# EasyEDA Pro project 数字电容表（嘉立创专业版）.epro, board 数字电容表PCB图
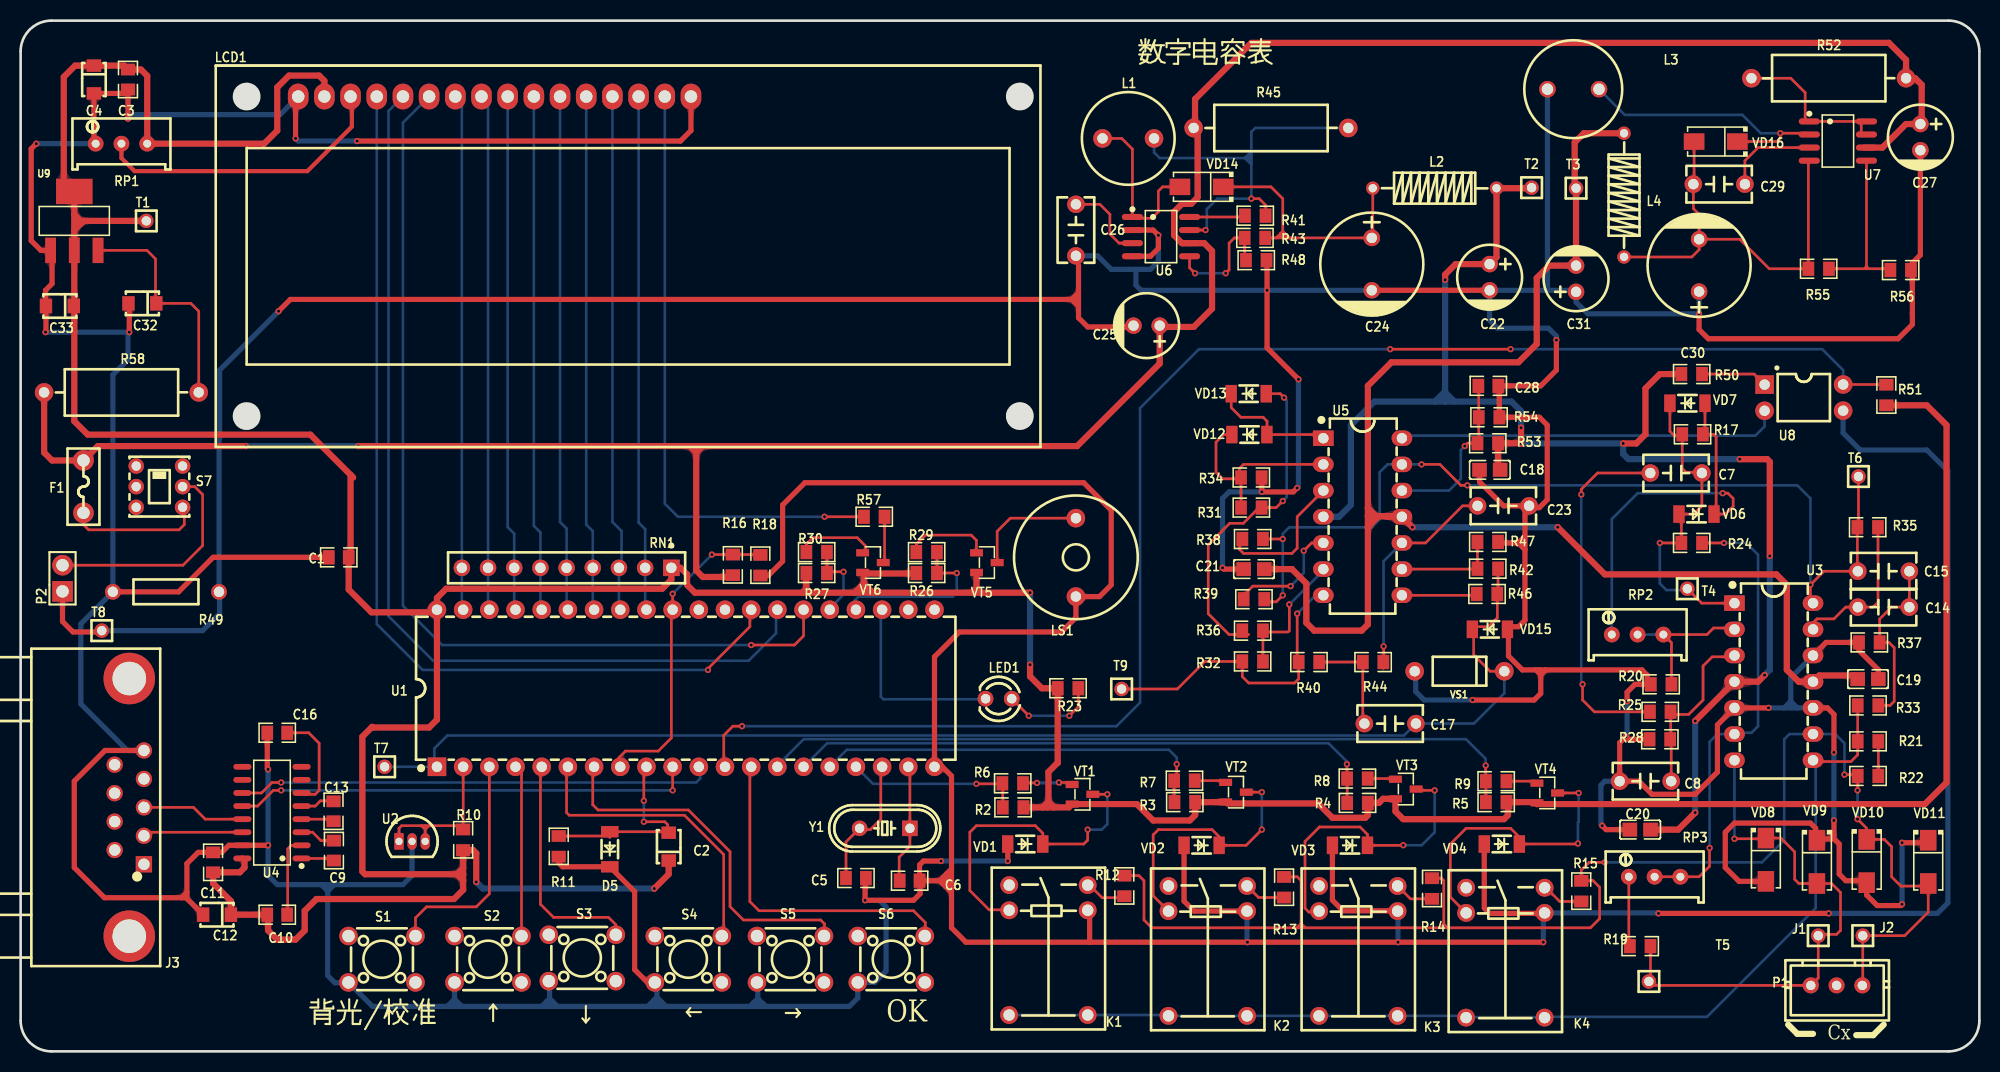
[diagram p1: board, top side]
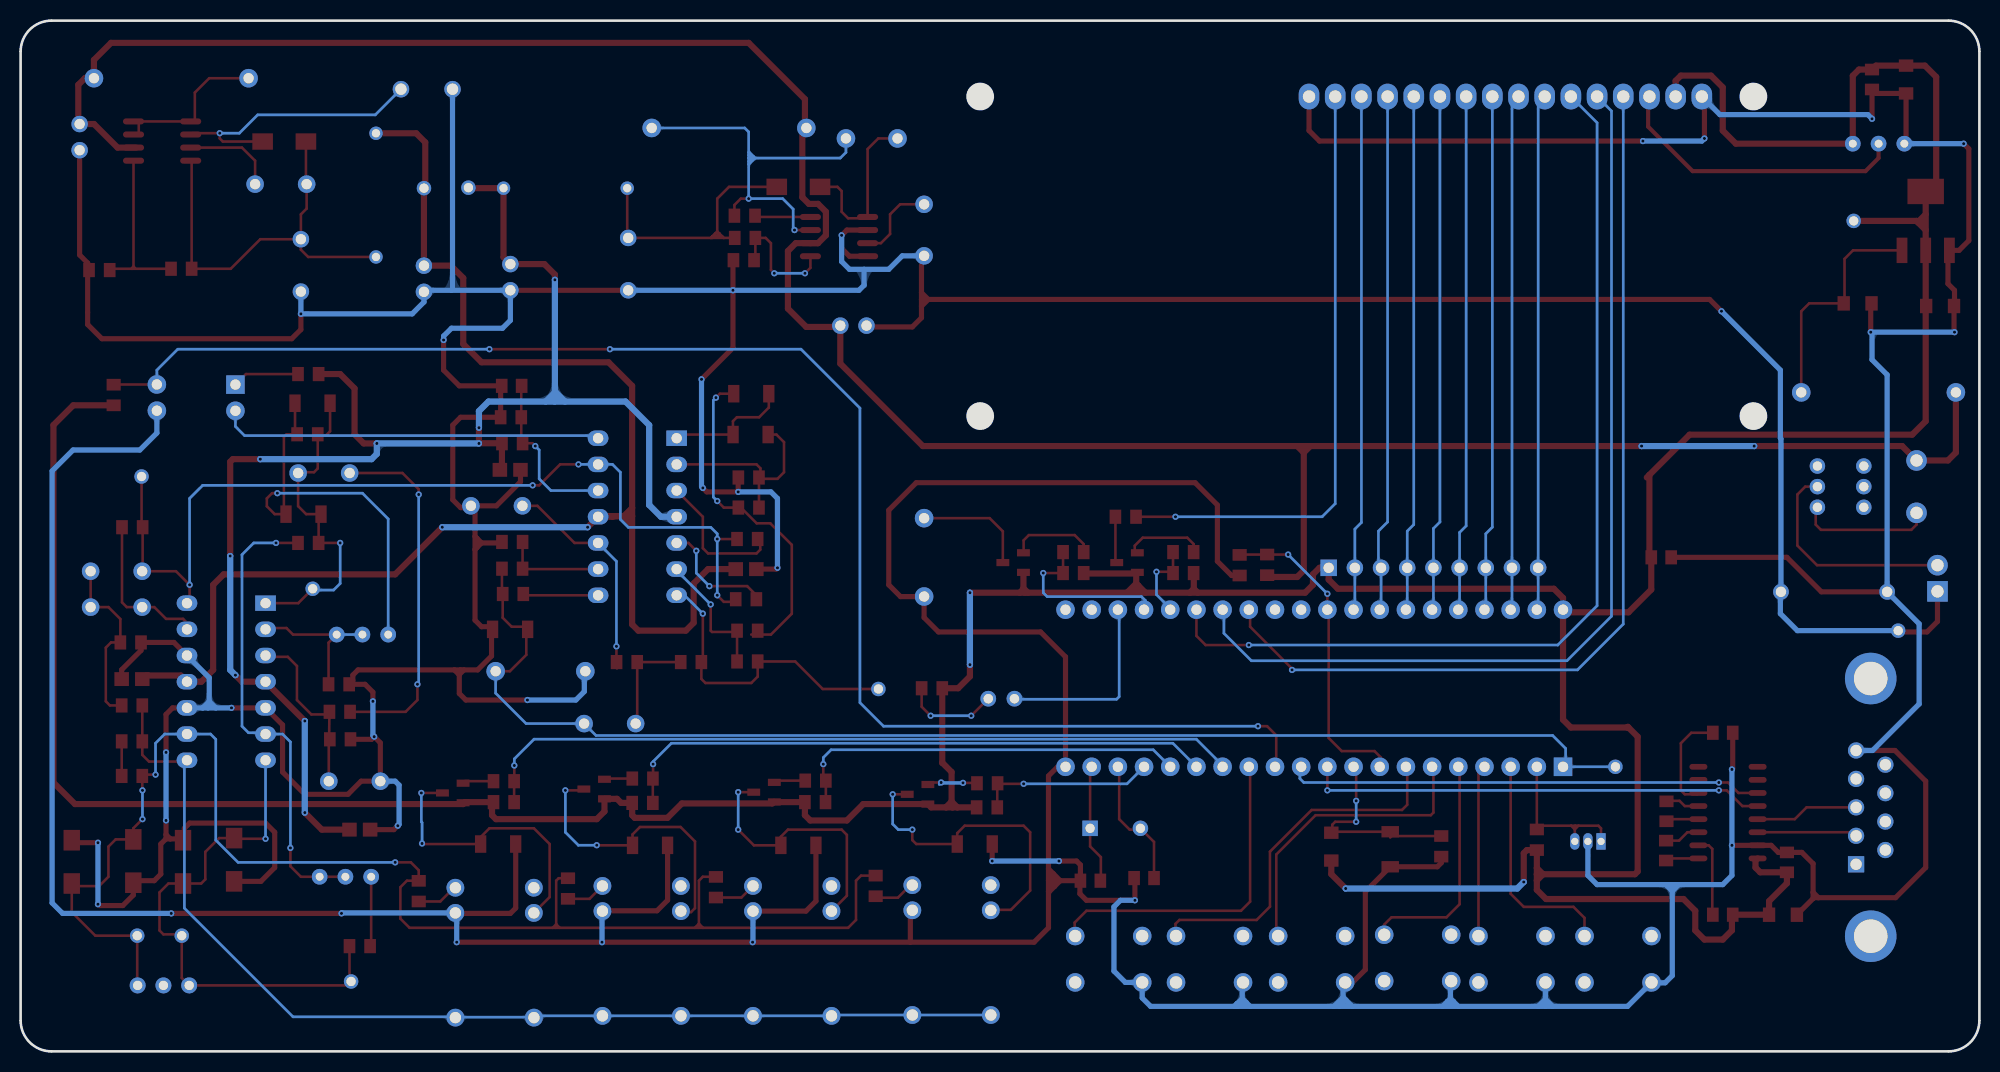
[diagram p2: board, bottom side, seen from below]

Outline 190 x 100 mm; copper layers: Top Layer, Bottom Layer. Coordinates in mm from the lower left corner of the outline.
Outline path: 0,97 0,3 arc(0.88,0.88) 3,0 187,0 arc(189.12,0.88) 190,3 190,97 arc(189.12,99.12) 187,100 3,100 arc(0.88,99.12) 0,97
Stack: Top Layer 0.035mm / Dielectric1 1.51mm FR4 er 4.5 / Bottom Layer 0.035mm

## Design rules (mm)
template: 自定义配置
spacing copperThickness1oz (default): track to track 0.102, other pairs 0.152 to 0.3
spacing copperThickness2oz: track to track 0.203, other pairs 0.152 to 0.3
track width copperThickness1oz: min 0.127, default 0.254, max 2.54
track width copperThickness2oz (default): min 0.203, default 0.254, max 2.54
track width PROWERandGND: min 0.4, default 0.6, max 0.6
track width A/DGND: min 0.4, default 0.5, max 0.6
differential pair differentialPair (default): width min 0.127, default 0.254, max 2.54; gap min 0.152, default 0.152
via viaSize (default): diameter min 0.5, default 0.61, max 10; hole min 0.3, default 0.305, max 6.3
net VCC uses PROWERandGND
net -12V uses PROWERandGND
net +12V uses PROWERandGND
net VIN uses PROWERandGND
net AGND uses A/DGND
net DGND uses A/DGND
net V0 uses PROWERandGND

## Placement (name value [footprint] x y rotation side)
C1  0.1uF  [R0805_NEW]  30.86 47.93 0 top
C2  10uF  [CAP-SMD_L3.2-W1.6]  62.87 19.86 90 top
C3  0.1uF  [R0805_NEW]  10.41 94.28 90 top
C4  10uF  [CAP-SMD_L3.2-W1.6]  7.11 94.28 270 top
C5  22pF  [R0805_NEW]  81.03 16.81 180 top
C6  22pF  [R0805_NEW]  86.23 16.56 180 top
C7  0.01uF  [CAP-TH_L6.5-W3.5-P5.00-D0.6]  160.58 56.11 0 top
C8  0.01uF  [CAP-TH_L6.5-W3.5-P5.00-D0.6]  157.61 26.21 0 top
C9  0.1uF  [R0805_NEW]  30.39 19.48 90 top
C10  0.1uF  [R0805_NEW]  24.89 13.26 180 top
C11  0.1uF  [R0805_NEW]  18.67 18.34 270 top
C12  10uF  [CAP-SMD_L3.2-W1.6]  19.05 13.26 180 top
C13  0.1uF  [R0805_NEW]  30.35 23.29 90 top
C14  0.01uF  [CAP-TH_L6.5-W3.5-P5.00-D0.6]  180.71 43.1 180 top
C15  0.01uF  [CAP-TH_L6.5-W3.5-P5.00-D0.6]  180.71 46.58 180 top
C16  0.1uF  [R0805_NEW]  24.89 30.91 0 top
C17  0.22uF  [CAP-TH_L6.5-W3.5-P5.00-D0.6]  132.84 31.8 0 top
C18  0.1uF  [C0805]  142.51 56.42 0 top
C19  0.1uF  [C0805]  179.2 36.12 180 top
C20  0.1uF  [C0805]  157.1 21.51 0 top
C21  0.1uF  [C0805]  119.63 46.79 0 top
C22  100uF  [CAP-TH_BD6.3-P2.50-D1.0-FD]  142.49 75.11 270 top
C23  0.22uF  [CAP-TH_L6.5-W3.5-P5.00-D0.6]  143.82 52.93 0 top
C24  1000uF  [CAP-TH_BD10.0-P5.00-D1.0-FD]  131.06 76.38 270 top
C25  100uF  [CAP-TH_BD6.3-P2.50-D1.0-FD]  109.22 70.41 180 top
C26  1500pF  [CAP-TH_L6.5-W3.5-P5.00-D0.6]  102.36 79.68 90 top
C27  100uF  [CAP-TH_BD6.3-P2.50-D1.0-FD]  184.28 88.7 270 top
C28  0.1uF  [R0805_NEW]  142.37 64.57 180 top
C29  1500pF  [CAP-TH_L6.5-W3.5-P5.00-D0.6]  164.76 84.14 0 top
C30  1000uF  [CAP-TH_BD10.0-P5.00-D1.0-FD]  162.81 76.25 90 top
C31  100uF  [CAP-TH_BD6.3-P2.50-D1.0-FD]  150.88 74.96 90 top
C32  10uF  [CAP-SMD_L3.2-W1.6]  11.81 72.57 180 top
C33  10uF  [CAP-SMD_L3.2-W1.6]  3.81 72.31 180 top
D5  1N4148  [LL-34_L3.5-W1.5-RD]  57.15 19.61 90 top
F1  1A/30V  [FUSE-TH_L7.4-W3.1-P5.08-D1.2]  6.1 54.79 90 top
J1  J1CX+  [hdr-th_1p-v-m_xkb_x4611wv-01i-c28d40]  174.37 11.23 0 top
J2  J2CX-  [hdr-th_1p-v-m_xkb_x4611wv-01i-c28d40]  178.69 11.23 0 top
J3  ISP-DIY  [DSUB-TH_DMR-9S]  10.54 23.67 180 top
K1  HK4100F-DC5V-SHG  [RELAY-TH_HK4100F-DC5V-SHG]  99.69 9.83 270 top
K2  HK4100F-DC5V-SHG  [RELAY-TH_HK4100F-DC5V-SHG]  115.15 9.75 270 top
K3  HK4100F-DC5V-SHG  [RELAY-TH_HK4100F-DC5V-SHG]  129.75 9.75 270 top
K4  HK4100F-DC5V-SHG  [RELAY-TH_HK4100F-DC5V-SHG]  144.02 9.58 270 top
L1  220uH  [IND-TH_BD9.0-P5.00-D0.7]  107.44 88.57 180 top
L2  1uH  [IND-TH_BD3.0-L8.0-P12.00-D0.6]  137.16 83.74 0 top
L3  100uH  [IND-TH_BD9.5-P5.00-D0.7]  150.61 93.35 180 top
L4  1uH  [IND-TH_BD3.0-L8.0-P12.00-D0.6]  155.53 83.07 90 top
LCD1  LCM1602K-FSW-FBW  [MODULE-TH_LCM1602K]  45.97 92.63 0 top
LED1  204-10SUGD/S400-A5  [LED-TH_BD3.0-P2.54-FD]  94.87 34.21 180 top
LS1  2.3kHz  [BUZ-TH_BD12.0-P7.60-D0.6-FD]  102.36 47.93 270 top
P1  B3B-XH-A(LF)(SN)  [CONN-TH_3P-P2.50_A2501WV2-3P]  176.15 6.4 0 top
P2  PZ254V-11-02P  [HDR-TH_2P-P2.54-V-M]  4.06 45.9 90 top
R2  10K  [R0805]  96.27 23.67 0 top
R3  10K  [R0805]  112.92 24.18 0 top
R4  10K  [R0805]  129.68 24.11 0 top
R5  10K  [R0805]  143.13 24.18 0 top
R6  2.2K  [R0805]  96.23 26.01 0 top
R7  2.2K  [R0805]  112.89 26.26 0 top
R8  2.2K  [R0805]  129.67 26.47 0 top
R9  2.2K  [R0805]  143.13 26.21 0 top
R10  1K  [R0805]  42.93 20.53 90 top
R11  2.2k  [R0805]  52.2 19.89 90 top
R12  430  [R0805]  107.06 16.05 270 top
R13  4.3K  [R0805]  122.55 15.93 270 top
R14  43K  [R0805]  136.91 15.8 270 top
R15  430K  [R0805]  151.38 15.54 270 top
R16  120K  [R0805]  69.09 47.2 90 top
R17  1k  [R0805]  162.18 59.87 180 top
R18  33K  [R0805]  71.75 47.17 270 top
R19  100  [R0805]  157.1 10.21 180 top
R20  2k  [R0805]  159.13 35.61 0 top
R21  4.3M  [R0805]  179.2 30.08 0 top
R22  0  [R0805]  179.2 26.72 180 top
R23  510  [R0805]  101.6 35.23 0 top
R24  10K  [R0805]  162.09 49.33 180 top
R25  43K  [R0805]  159.04 32.94 180 top
R26  10k  [R0805]  87.88 46.41 0 top
R27  10k  [R0805]  77.22 46.41 0 top
R28  43K  [R0805]  159 30.28 0 top
R29  2.2k  [R0805]  87.88 48.44 0 top
R30  2.2k  [R0805]  77.22 48.44 0 top
R31  10K  [R0805]  119.38 52.76 180 top
R32  20K  [R0805]  119.51 37.83 180 top
R33  75K  [R0805]  179.2 33.56 0 top
R34  10K  [R0805]  119.38 55.68 180 top
R35  180K  [R0805]  179.16 50.85 180 top
R36  10K  [R0805]  119.51 40.81 0 top
R37  11K  [R0805]  179.32 39.67 180 top
R38  5.1K  [R0805]  119.51 49.71 0 top
R39  5.1K  [R0805]  119.63 43.87 0 top
R40  120K  [R0805]  124.97 37.77 180 top
R41  180  [R0805]  119.76 81.08 0 top
R42  5.1K  [R0805]  142.31 46.83 0 top
R43  20K  [R0805]  119.73 78.92 180 top
R44  120K  [R0805]  131.19 37.77 180 top
R45  0.22/2W  [RES-TH_BD4.5-L11.0-P15.00-D0.7]  121.28 89.59 0 top
R46  1K  [R0805]  142.24 44.37 180 top
R47  10K  [R0805]  142.31 49.42 180 top
R48  2.2k  [R0805]  119.86 76.76 180 top
R49  0Ω  [RES-TH_BD2.4-L6.3-P10.30-D0.6]  14.1 44.58 180 top
R50  10K  [R0805]  162.09 65.71 0 top
R51  10K  [R0805]  180.97 63.68 90 top
R52  0.22/2W  [RES-TH_BD4.5-L11.0-P15.00-D0.7]  175.39 94.41 180 top
R53  15K  [R0805]  142.31 59 180 top
R54  10K  [R0805]  142.44 61.52 0 top
R55  2.2k  [R0805]  174.41 75.93 180 top
R56  20k  [R0805]  182.36 75.8 0 top
R57  33  [R0805]  82.8 51.87 0 top
R58  20/1W  [RES-TH_BD4.5-L11.0-P15.00-D0.7]  9.78 63.93 0 top
RN1  10kΩ  [RES-ARRAY-TH_9P-P2.54-D1.0]  52.96 46.91 180 top
RP1  20kΩ  [RES-ADJ-TH_3P-L10.0-W10.0-P2.50-L]  9.78 88.06 0 top
RP2  10kΩ  [RES-ADJ-TH_3P-L10.0-W10.0-P2.50-L]  156.84 40.44 0 top
RP3  1K  [RES-ADJ-TH_3P-L10.0-W10.0-P2.50-L]  158.5 16.94 0 top
S1  TS665CJ  [SW-TH_4P-L6.0-W6.0-P4.50-LS6.5]  35.05 8.94 0 top
S2  TS665CJ  [SW-TH_4P-L6.0-W6.0-P4.50-LS6.5]  45.34 8.94 0 top
S3  TS665CJ  [SW-TH_4P-L6.0-W6.0-P4.50-LS6.5]  54.48 9.07 0 top
S4  TS665CJ  [SW-TH_4P-L6.0-W6.0-P4.50-LS6.5]  64.77 8.94 0 top
S5  TS665CJ  [SW-TH_4P-L6.0-W6.0-P4.50-LS6.5]  74.68 8.94 0 top
S6  TS665CJ  [SW-TH_4P-L6.0-W6.0-P4.50-LS6.5]  84.45 8.94 0 top
S7  PS-5850A-6PL  [SW-TH_6P-L5.8-W5.8-P2.00-LS4.5-BL]  13.46 54.79 90 top
T1  -  [hdr-th_1p-v-m_xkb_x4611wv-01i-c28d40]  12.19 80.57 0 top
T2  -  [hdr-th_1p-v-m_xkb_x4611wv-01i-c28d40]  146.56 83.79 0 top
T3  -  [hdr-th_1p-v-m_xkb_x4611wv-01i-c28d40]  150.88 83.74 0 top
T4  -  [hdr-th_1p-v-m_xkb_x4611wv-01i-c28d40]  161.67 44.88 0 top
T5  -  [hdr-th_1p-v-m_xkb_x4611wv-01i-c28d40]  157.94 6.78 0 top
T6  -  [hdr-th_1p-v-m_xkb_x4611wv-01i-c28d40]  178.27 55.77 0 top
T7  -  [hdr-th_1p-v-m_xkb_x4611wv-01i-c28d40]  35.31 27.61 0 top
T8  -  [hdr-th_1p-v-m_xkb_x4611wv-01i-c28d40]  7.87 40.82 0 top
T9  -  [hdr-th_1p-v-m_xkb_x4611wv-01i-c28d40]  106.79 35.16 0 top
U1  STC12C5A32S2-35I-PDIP40  [DIP-40_L52.3-W13.9-P2.54-LS15.2-BL]  64.52 35.23 0 top
U2  TL431  [TO-92-3_L4.9-W3.7-P1.27-L]  37.97 20.37 0 top
U3  TL084  [DIP-14_L18.9-W6.4-P2.54-LS7.6-BL]  170.05 35.86 270 top
U4  MAX232ESE  [SOP-16_L10.0-W3.9-P1.27-LS6.0-BL]  24.38 23.16 90 top
U5  TL084  [DIP-14_L18.9-W6.4-P2.54-LS7.6-BL]  130.17 51.87 270 top
U6  MC34063A  [SOIC-8_L4.9-W3.9-P1.27-LS6.0-BL]  110.62 79.04 270 top
U7  MC34063A  [SOIC-8_L4.9-W3.9-P1.27-LS6.0-BL]  176.28 88.32 270 top
U8  TLP521  [DIP-4_L6.4-W4.6-P2.54-LS7.6-BL]  172.97 63.42 270 top
U9  AMS1117-5.0  [SOT-223_L6.5-W3.5-P2.30-LS7.0-BR]  5.21 80.57 270 top
VD1  1N4148  [LL-34_L3.5-W1.5-RD#2]  97.45 20.12 180 top
VD2  1N4148  [LL-34_L3.5-W1.5-RD#2]  114.55 19.99 180 top
VD3  1N4148  [LL-34_L3.5-W1.5-RD#2]  128.94 19.99 180 top
VD4  1N4148  [LL-34_L3.5-W1.5-RD#2]  143.68 20.12 180 top
VD6  1N4148  [LL-34_L3.5-W1.5-RD#2]  162.56 52.12 180 top
VD7  1N4148  [LL-34_L3.5-W1.5-RD#2]  161.68 62.88 0 top
VD8  1N4007  [SMA_L4.3-W2.5-LS5.0-RD]  169.29 18.59 270 top
VD9  1N4007  [SMA_L4.3-W2.5-LS5.0-RD]  174.24 18.39 270 top
VD10  1N4007  [SMA_L4.3-W2.5-LS5.0-RD]  179.07 18.47 270 top
VD11  1N4007  [SMA_L4.3-W2.5-LS5.0-RD]  185.04 18.39 270 top
VD12  1N4148  [LL-34_L3.5-W1.5-RD#2]  119.19 59.84 0 top
VD13  1N4148  [LL-34_L3.5-W1.5-RD#2]  119.13 63.8 0 top
VD14  1N5819W  [SMA_L4.3-W2.5-LS5.0-RD]  114.55 83.87 180 top
VD15  1N4148  [LL-34_L3.5-W1.5-RD#2]  142.52 40.94 0 top
VD16  1N5819W  [SMA_L4.3-W2.5-LS5.0-RD]  164.42 88.27 180 top
VS1  1N4733A  [DO-41_BD2.4-L4.7-P8.70-D0.9-RD]  139.57 36.88 180 top
VT1  S9012  [SOT-23-3_L2.9-W1.3-P1.90-LS2.4-BR]  103 24.94 180 top
VT2  9012  [SOT-23-3_L2.9-W1.3-P1.90-LS2.4-BR]  117.89 25.15 180 top
VT3  S9012  [SOT-23-3_L2.9-W1.3-P1.90-LS2.4-BR]  134.37 25.45 180 top
VT4  9012  [SOT-23-3_L2.9-W1.3-P1.90-LS2.4-BR]  148.08 25.07 180 top
VT5  9012  [SOT-23-3_L2.9-W1.3-P1.90-LS2.4-BR]  93.73 47.42 180 top
VT6  9012  [SOT-23-3_L2.9-W1.3-P1.90-LS2.4-BR]  82.68 47.42 180 top
Y1  11.0592MHz  [HC-49US_L11.5-W4.5-P4.88]  83.82 21.64 180 top

## Footprints (pads in the part's own frame, mm; a bottom-side part is the same pattern mirrored in y, then rotated)
BUZ-TH_BD12.0-P7.60-D0.6-FD
  round 1.8 hole 1: 1(-3.8,0) 2(3.8,0)
C0805
  rect 1.41x1.35 smd: 1(-1,0) 2(1,0)
CAP-SMD_L3.2-W1.6
  rect 1.2x1.4 smd: 1(-1.35,0) 2(1.35,0)
CAP-TH_BD6.3-P2.50-D1.0-FD
  round 1.6 hole 1: 1(-1.27,0) 2(1.27,0)
CAP-TH_BD10.0-P5.00-D1.0-FD
  round 1.6 hole 1: 1(-2.54,0) 2(2.54,0)
CAP-TH_L6.5-W3.5-P5.00-D0.6
  round 1.7 hole 1: 1(-2.5,0) 2(2.5,0)
CONN-TH_3P-P2.50_A2501WV2-3P
  round 1.55 hole 0.9: 1(-2.5,0) 2(0,0) 3(2.5,0)
DIP-4_L6.4-W4.6-P2.54-LS7.6-BL
  rect 1.8x1.8 hole 1: 1(-1.265,-3.81)
  round 1.8 hole 1: 2(1.275,-3.81) 3(1.265,3.81) 4(-1.275,3.81)
DIP-14_L18.9-W6.4-P2.54-LS7.6-BL
  rect 1.5x2 hole 1: 1(-7.62,-3.81)
  oval 1.5x2 hole 1: 2(-5.08,-3.81) 3(-2.54,-3.81) 4(0,-3.81) 5(2.54,-3.81) 6(5.08,-3.81) 7(7.62,-3.81) 8(7.62,3.81) 9(5.08,3.81) 10(2.54,3.81) 11(0,3.81) 12(-2.54,3.81) 13(-5.08,3.81) 14(-7.62,3.81)
DIP-40_L52.3-W13.9-P2.54-LS15.2-BL
  rect 1.8x1.8 hole 1: 1(-24.13,-7.62)
  round 1.8 hole 1: 2(-21.59,-7.62) 3(-19.05,-7.62) 4(-16.51,-7.62) 5(-13.97,-7.62) 6(-11.43,-7.62) 7(-8.89,-7.62) 8(-6.35,-7.62) 9(-3.81,-7.62) 10(-1.27,-7.62) 11(1.27,-7.62) 12(3.81,-7.62) 13(6.35,-7.62) 14(8.89,-7.62) 15(11.43,-7.62) 16(13.97,-7.62) 17(16.51,-7.62) 18(19.05,-7.62) 19(21.59,-7.62) 20(24.13,-7.62) 21(24.13,7.62) 22(21.59,7.62) 23(19.05,7.62) 24(16.51,7.62) 25(13.97,7.62) 26(11.43,7.62) 27(8.89,7.62) 28(6.35,7.62) 29(3.81,7.62) 30(1.27,7.62) 31(-1.27,7.62) 32(-3.81,7.62) 33(-6.35,7.62) 34(-8.89,7.62) 35(-11.43,7.62) 36(-13.97,7.62) 37(-16.51,7.62) 38(-19.05,7.62) 39(-21.59,7.62) 40(-24.13,7.62)
DO-41_BD2.4-L4.7-P8.70-D0.9-RD
  round 1.8 hole 1: 1(-4.35,0) 2(4.35,0)
DSUB-TH_DMR-9S
  rect 1.575x1.575 hole 1.1: 1(-1.42,5.52)
  round 1.575 hole 1.1: 2(-1.42,2.76) 3(-1.42,0) 4(-1.42,-2.76) 5(-1.42,-5.52) 6(1.42,4.14) 7(1.42,1.38) 8(1.42,-1.38) 9(1.42,-4.14)
  round 5 hole 3.25: 10(0,12.5) 11(0,-12.5)
FUSE-TH_L7.4-W3.1-P5.08-D1.2
  round 2 hole 1.2: 1(-2.54,0) 2(2.54,0)
HC-49US_L11.5-W4.5-P4.88
  rect 1.5x1.5 hole 0.9: 1(-2.44,0)
  round 1.5 hole 0.9: 2(2.44,0)
hdr-th_1p-v-m_xkb_x4611wv-01i-c28d40
  round 1.4 hole 0.9: 1(0,0)
HDR-TH_2P-P2.54-V-M
  rect 2x2 hole 1.2: 1(-1.27,0)
  round 2 hole 1.2: 2(1.27,0)
IND-TH_BD3.0-L8.0-P12.00-D0.6
  round 1.3 hole 0.8: 1(-6,0) 2(6,0)
IND-TH_BD9.0-P5.00-D0.7
  round 1.8 hole 1: 1(-2.5,0) 2(2.5,0)
IND-TH_BD9.5-P5.00-D0.7
  round 1.6 hole 1.1: 1(-2.5,0) 2(2.5,0)
LED-TH_BD3.0-P2.54-FD
  round 1.524 hole 0.914: 1(-1.27,0) 2(1.27,0)
LL-34_L3.5-W1.5-RD
  rect 1.1x1.7 smd: 1(1.7,0) 2(-1.7,0)
LL-34_L3.5-W1.5-RD#2
  rect 1.1x1.7 smd: 1(-1.7,0) 2(1.7,0)
MODULE-TH_LCM1602K
  oval 2x2.5 hole 1.2: 1(-19.05,0) 2(-16.51,0) 3(-13.97,0) 4(-11.43,0) 5(-8.89,0) 6(-6.35,0) 7(-3.81,0) 8(-1.27,0) 9(1.27,0) 10(3.81,0) 11(6.35,0) 12(8.89,0) 13(11.43,0) 14(13.97,0) 15(16.51,0) 16(19.05,0)
R0805
  rect 1.133x1.377 smd: 1(-1,0) 2(1,0)
R0805_NEW
  rect 1.133x1.377 smd: 1(-0.966,0) 2(0.966,0)
RELAY-TH_HK4100F-DC5V-SHG
  round 1.727 hole 1.1: 1(-6.301,3.81) 2(-6.301,-3.8) 3(-3.86,3.81) 4(-3.86,-3.803) 5(6.301,3.81) 5(6.301,-3.81)
RES-ADJ-TH_3P-L10.0-W10.0-P2.50-L
  round 1.524 hole 0.762: 1(-2.5,0) 2(0,0) 3(2.5,0)
RES-ARRAY-TH_9P-P2.54-D1.0
  rect 1.6x1.6 hole 1: 1(-10.16,0)
  round 1.6 hole 1: 2(-7.62,0) 3(-5.08,0) 4(-2.54,0) 5(0,0) 6(2.54,0) 7(5.08,0) 8(7.62,0) 9(10.16,0)
RES-TH_BD2.4-L6.3-P10.30-D0.6
  round 1.524 hole 1: 1(-5.15,0) 2(5.15,0)
RES-TH_BD4.5-L11.0-P15.00-D0.7
  round 1.8 hole 1: 1(-7.5,0) 2(7.5,0)
SMA_L4.3-W2.5-LS5.0-RD
  rect 2x1.593 smd: 1(-2.1,0) 2(2.1,0)
SOIC-8_L4.9-W3.9-P1.27-LS6.0-BL
  oval 0.588x2.045 smd: 1(-1.905,-2.772) 2(-0.635,-2.772) 3(0.635,-2.772) 4(1.905,-2.772) 5(1.905,2.772) 6(0.635,2.772) 7(-0.635,2.772) 8(-1.905,2.772)
SOP-16_L10.0-W3.9-P1.27-LS6.0-BL
  oval 0.56x1.745 smd: 1(-4.445,-2.873) 2(-3.175,-2.873) 3(-1.905,-2.873) 4(-0.635,-2.873) 5(0.635,-2.873) 6(1.905,-2.873) 7(3.175,-2.873) 8(4.445,-2.873) 9(4.445,2.873) 10(3.175,2.873) 11(1.905,2.873) 12(0.635,2.873) 13(-0.635,2.873) 14(-1.905,2.873) 15(-3.175,2.873) 16(-4.445,2.873)
SOT-23-3_L2.9-W1.3-P1.90-LS2.4-BR
  rect 1.25x0.7 smd: 1(1,-0.95) 2(1,0.95) 3(-1,0)
SOT-223_L6.5-W3.5-P2.30-LS7.0-BR
  rect 2.465x1.05 smd: 1(2.857,-2.3) 2(2.857,0) 3(2.857,2.3)
  rect 2.465x3.54 smd: 4(-2.857,0)
SW-TH_4P-L6.0-W6.0-P4.50-LS6.5
  round 1.8 hole 1.2: 1(-3.25,2.25) 2(3.25,2.25) 3(-3.25,-2.25) 4(3.25,-2.25)
SW-TH_6P-L5.8-W5.8-P2.00-LS4.5-BL
  round 1.5 hole 0.9: 1(-2,-2.25) 2(0,-2.25) 3(2,-2.25) 4(-2,2.25) 5(0,2.25) 6(2,2.25)
TO-92-3_L4.9-W3.7-P1.27-L
  rect 0.9x1.6 hole 0.7: 1(-1.27,0)
  oval 0.9x1.6 hole 0.7: 2(0,0) 3(1.27,0)

## Nets
As in the schematic.

Pads without a net: J3 1 4 6 7 8 9 10 11; K1 2; K2 2; K3 2; K4 2; P1 2; S1 1 4; S2 1 4; S3 1 4; S4 1 4; S5 1 4; S6 1 4; S7 3 4 5 6; U1 21 22 29 30; U4 7 8 9 10

## Via types
v1: diameter 0.61, hole 0.305, Top Layer to Bottom Layer, 111 vias

## Routing (per net, layer and track width the routed paths; a pad name or vN(x,y) marks a point on that pad's centre or on a via; arc(x,y) is an arc through that point)
+12V: length 147.4
  Top Layer w0.6: C18.2 143.31,56.62 R53.1 145.52,59 v1(145.54,58.98) v1(145.54,60.5) ; R50.1 159,65.71 157.61,64.31 157.61,59.87 156.72,58.98 v1(155.45,58.98) ; v1(162.43,23.16) 160.78,21.51 C20.2 ; v1(169.16,36.5) 168.53,35.86 U3.4 v1(162.43,32.05) ; v1(138.18,74.85) 138.18,75.36 139.19,76.38 C22.1 143.16,77.04 L2.2 146.52,83.74 T2.1 ; v1(166.75,57.45) 169.42,57.45 169.67,57.2 v1(169.67,48.06)
  Bottom Layer w0.6: v1(145.54,58.98) v1(155.45,58.98) 155.45,57.96 155.96,57.45 v1(166.75,57.45) ; v1(145.54,60.5) 145.54,62.11 144.61,63.04 139.07,63.04 ; U5.4 127.89,51.87 129.03,53.01 129.03,60.76 131.32,63.04 137.19,63.04 ; 138.21,63.04 138.18,63.07 138.18,63.94 ; 138.21,63.04 137.19,63.04 ; 138.21,63.04 139.07,63.04 ; 137.19,63.04 138.09,63.94 138.18,63.94 ; 138.18,63.94 139.07,63.04 ; 138.18,63.94 v1(138.18,74.85) ; v1(169.67,48.06) 169.67,37.01 v1(169.16,36.5) ; v1(162.43,32.05) v1(162.43,23.16)
-12V: length 147.5
  Top Layer w0.6: 131.45,51.93 131.58,51.8 130.68,50.9 ; 131.45,51.93 130.68,51.93 ; 131.45,51.93 131.45,51.95 130.68,52.72 ; 131.45,51.93 132.08,51.93 ; 132.08,51.93 132.59,51.87 ; 132.08,51.93 133.92,51.93 133.98,51.87 ; 132.59,51.87 132.59,51.93 ; 132.59,51.87 133.98,51.87 ; 177.81,36.46 174.46,36.46 U3.11 172.47,35.86 171.32,37.01 171.32,45.26 170.31,46.28 153.67,46.28 v1(149.1,50.85) ; 133.98,51.87 U5.11 v1(135,50.85) ; T3.1 150.75,83.87 150.75,88.19 151.63,89.07 L4.2 ; 130.68,51.93 130.68,50.9 ; 130.68,51.93 130.68,52.72 ; 130.68,50.9 130.68,41.42 130.08,40.82 125.48,40.82 124.71,41.58 124.71,45.39 123.32,46.79 C21.2 ; 150.88,83.74 C31.2 148.26,76.23 147.07,75.03 147.07,68.63 145.29,66.85 132.97,66.85 130.68,64.57 130.68,52.72
  Bottom Layer w0.6: v1(135,50.85) v1(149.1,50.85)
AGND: length 540.1
  Top Layer w0.5: 145.29,49.33 143.41,49.33 R47.1 ; 145.29,49.33 145.74,49.78 ; 145.29,49.33 145.74,48.87 ; v1(123.82,54.66) 123.44,54.28 v1(120.4,54.28) 120.4,55.66 R34.1 ; 102.62,73.61 102.62,76.28 ; 102.62,73.61 102.62,72.95 ; 102.62,73.61 101.96,72.95 ; C23.2 143.85,52.93 141.51,55.26 C18.1 ; C23.2 146.49,52.76 147.32,52.76 148.08,53.52 148.08,60.76 147.32,61.52 R54.2 143.44,64.46 C28.1 147.45,64.57 148.97,66.09 v1(148.97,69.01) ; C23.2 145.92,52.53 145.92,49.96 ; 145.92,49.96 145.92,48.69 ; 145.92,49.96 145.74,49.78 ; 145.92,48.69 145.74,48.87 ; 145.92,48.69 145.92,41.83 145.29,41.2 144.32,41.2 144.32,38.36 145.67,37.01 147,37.01 ; P2.1 4.06,41.71 5.08,40.69 7.75,40.69 T8.1 ; 145.74,49.78 145.74,48.87 ; 101.96,72.95 26.16,72.95 v1(25.02,71.81) ; 101.96,72.95 102.62,72.29 ; 101.96,72.95 102.62,72.95 ; 147.45,36.57 147.48,36.57 147.92,37.01 ; 147.45,36.57 147.45,34.72 146.81,34.09 v1(140.84,34.09) ; 147.45,36.57 147,37.01 ; 147.45,36.57 147.45,36.9 147.34,37.01 ; v1(182.5,14.28) 182.37,14.15 180.09,14.15 179.07,15.16 VD10.2 178.88,16.56 177.04,16.56 176.4,17.2 176.4,20.12 175.91,20.61 ; v1(182.5,20.24) 184.8,20.24 VD11.1 ; 147.92,37.01 157.27,37.01 157.77,36.51 157.77,35.97 R20.1 156.59,35.61 155.83,34.85 v1(155.83,33.96) ; 147.92,37.01 147.34,37.01 ; 175.48,20.61 175.91,20.61 ; 175.48,20.61 175.89,21.03 ; 175.48,20.61 174.12,20.61 ; 175.91,20.61 175.89,20.62 175.89,21.03 ; C27.2 184.28,77.27 183.5,76.49 183.5,70.52 182.12,69.14 163.7,69.14 162.81,70.03 v1(162.81,71.55) ; C20.1 153.8,21.51 v1(153.42,21.89) ; R48.1 120.9,76.71 v1(120.9,73.84) 120.9,68.25 v1(123.95,65.2) ; 102.62,72.29 102.62,72.95 ; 102.62,72.29 102.62,71.17 103.5,70.28 107.36,70.28 ; U6.4 109.6,77.14 110.36,77.9 v1(110.36,79.17) 109.85,79.68 U6.2 ; 147,37.01 147.34,37.01 ; 175.89,21.03 v1(175.89,22.4) ; v1(169.54,33.32) U3.5 164.59,31.67 164.59,27.1 162.43,24.94 158.24,24.94 156.97,26.21 C8.1 155.11,29.94 v1(155.7,30.53) 155.96,30.28 R28.1 ; U3.12 175.13,39.67 R37.2 178.32,38.9 180.2,37.02 C19.1 ; v1(116.59,46.91) 116.71,46.79 C21.1 ; 174.12,20.61 174.12,21.64 173.61,22.15 166.24,22.15 165.35,21.26 165.35,17.83 166.69,16.49 VD8.2 ; 174.12,20.61 VD9.1 ; v1(175.89,29.01) 175.89,32.69 175.26,33.32 U3.10 ; C24.2 C22.2
  Bottom Layer w0.5: C30.1 v1(162.81,71.55) 152.02,71.55 150.88,72.69 150.88,73.69 150.73,73.84 148.22,73.84 ; 171.7,33.96 171.7,36.25 U3.12 ; 171.7,33.96 171.7,33.45 171.83,33.32 ; 171.7,33.96 172.34,33.33 172.34,33.32 ; 171.7,33.96 171.07,33.32 ; 148.22,73.84 C22.2 142.49,70.92 143.26,70.15 148.21,70.15 148.97,69.39 v1(148.97,69.01) ; 148.22,73.84 148.11,73.95 L3.2 ; v1(155.7,30.53) 155.83,30.66 v1(155.83,33.96) ; v1(153.42,21.89) 153.29,22.02 153.29,25.83 153.67,26.21 C8.1 ; C26.1 104.48,77.18 105.79,75.87 108.18,75.87 ; v1(120.4,54.28) 117.22,54.28 116.59,53.64 v1(116.59,46.91) ; T8.1 17.65,40.82 19.3,42.47 19.3,44.53 19.25,44.58 19.25,59.43 19.3,59.49 19.3,66.09 v1(25.02,71.81) ; v1(123.95,65.2) 123.95,54.79 v1(123.82,54.66) ; 108.18,75.87 109.6,75.87 110.36,76.63 v1(110.36,79.17) ; 108.18,75.87 108.18,74.34 108.68,73.84 v1(120.9,73.84) C24.2 ; v1(182.5,14.28) v1(182.5,20.24) ; 171.07,33.32 171.83,33.32 ; 171.07,33.32 v1(169.54,33.32) ; v1(140.84,34.09) 136.14,34.09 135.32,34.91 135.32,37.01 ; 172.34,33.32 171.83,33.32 ; 172.34,33.32 U3.10 ; v1(175.89,29.01) v1(175.89,22.4)
DGND: length 698.4
  Top Layer w0.5: 90.3,15.5 90.3,11.99 91.69,10.59 103.7,10.59 ; 90.3,15.5 90.3,16.57 ; 90.3,15.5 90.21,15.5 89.71,16 ; v1(89.28,18.47) 87.57,18.47 87.2,18.09 C6.1 ; C32.2 10.54,72.49 v1(10.54,69.77) ; 89.82,17.23 89.82,16.56 ; 89.82,17.23 90.3,17.7 ; 89.82,17.23 89.15,16.56 ; 89.82,16.56 90.28,16.56 90.3,16.57 ; 89.82,16.56 89.15,16.56 ; 89.82,16.56 89.82,16.12 89.71,16 ; S4.3 60.8,6.69 59.56,7.92 59.56,15.5 D5.2 52.58,17.91 52.2,18.29 R11.1 ; 15.61,14.91 16.05,14.91 16.13,14.83 ; 15.61,14.91 8.13,14.91 5.21,17.83 5.21,26.21 8.19,29.19 J3.5 ; 15.61,14.91 16.13,15.43 ; C5.1 81.91,16.74 v1(81.91,14.66) 86.61,14.66 87.25,15.29 87.25,16.51 C6.1 ; 90.3,17.7 90.3,16.57 ; 90.3,17.7 90.3,26.72 89.41,27.61 U1.20 88.65,38.28 91.06,40.69 100.97,40.69 102.36,42.09 LS1.2 102.37,44.12 104.65,44.12 105.79,45.26 105.79,52.5 103.12,55.17 76.07,55.17 73.91,53.01 73.91,47.55 72.53,46.17 R18.2 ; v1(32.64,88.32) 64.01,88.32 65.02,89.33 LCD1.16 ; U9.1 1.97,77.71 1.02,78.66 1.02,87.56 v1(1.52,88.06) ; v1(175.39,13.39) v1(158.88,13.39) ; 103.7,10.59 v1(119,10.59) v1(133.6,10.59) v1(147.7,10.59) ; 103.7,10.59 103.7,13.5 K1.3 ; C6.1 89.15,16.56 ; v1(24,27.36) 23.93,27.43 C16.1 ; 89.15,16.56 89.71,16 ; VD3.2 127.24,14.66 128.27,13.64 133.53,13.64 K3.3 ; C1.1 18.67,47.93 15.32,44.58 8.95,44.58 ; 16.13,14.83 C12.2 ; 16.13,14.83 16.13,15.43 ; 16.13,15.43 16.13,18.21 17.22,19.31 C11.1 19.51,19.31 20.19,19.99 U4.15 v1(24,19.99) ; K2.3 113.82,13.61 112.85,14.58 VD2.2 ; VD4.2 141.98,13.9 142.49,13.39 147.78,13.39 K4.3 ; VD1.2 95.76,20.11 v1(95.76,18.47) ; v1(26.67,88.57) 26.67,92.38 LCD1.1 ; v1(2.41,69.77) 2.46,69.82 C33.2 2.41,72.36 2.41,73.84 3.05,74.47 3.05,77.52 ; v1(10.41,90.47) C3.1 10.03,92.94 C4.2 7.11,88.23 RP1.1
  Bottom Layer w0.5: 29.15,16.18 24.89,16.18 24,17.07 v1(24,19.99) v1(24,27.36) ; 29.15,16.18 29.79,16.18 ; 29.15,16.18 29.79,15.54 ; 60.83,4.37 62.05,4.37 ; 60.83,4.37 61.44,4.98 ; 60.83,4.37 52.07,4.37 ; 62.05,4.37 61.44,4.98 ; 62.05,4.37 62.61,4.37 ; 61.44,4.98 61.72,5.26 ; 71.5,5.13 72.01,4.62 ; 71.5,5.13 71.5,6.62 S5.3 ; 71.5,5.13 71.11,4.74 ; 72.01,4.62 72.01,4.37 ; 72.01,4.62 72.03,4.62 72.28,4.37 ; 29.79,15.54 29.79,7.35 30.48,6.66 31.77,6.66 S1.3 34.12,4.37 41.38,4.37 ; 29.79,15.54 30.42,16.18 ; 29.79,15.54 29.79,16.18 ; 72.01,4.37 71.65,4.74 71.11,4.74 ; 72.01,4.37 70.74,4.37 ; 72.01,4.37 72.28,4.37 ; U2.2 37.97,17.07 37.08,16.18 30.42,16.18 ; 29.79,16.18 30.42,16.18 ; 72.28,4.37 80.39,4.37 81.2,5.18 S6.3 82.84,6.69 83.95,7.8 83.95,14.02 83.31,14.66 v1(81.91,14.66) ; 42.79,4.37 42.79,4.37 42.09,5.07 ; 42.79,4.37 42.09,4.37 ; 42.79,4.37 50.55,4.37 ; 71.11,4.74 70.74,4.37 ; 61.72,5.26 62.61,4.37 ; 61.72,5.26 61.72,6.49 S4.3 ; v1(119,10.59) 118.96,10.63 K2.3 ; 52.07,4.37 51.6,4.84 ; 52.07,4.37 50.55,4.37 ; 51.6,4.84 51.02,4.84 ; 51.6,4.84 51.31,5.13 ; K3.3 133.6,13.57 v1(133.6,10.59) ; 62.61,4.37 70.74,4.37 ; 42.09,5.07 S2.3 ; 42.09,5.07 41.38,4.37 ; 42.09,5.07 42.09,4.37 ; U8.3 176.78,59.99 178.44,58.34 184.91,58.34 186.94,56.31 186.94,14.4 185.93,13.39 v1(175.39,13.39) ; v1(26.67,88.57) 26.92,88.32 v1(32.64,88.32) ; v1(158.88,13.39) 158.83,13.44 K4.3 147.7,13.31 v1(147.7,10.59) ; 51.02,4.84 51.31,5.13 ; 51.02,4.84 50.55,4.37 ; 51.31,5.13 51.31,6.74 S3.3 ; 42.09,4.37 41.38,4.37 ; v1(10.41,90.47) 10.82,90.88 25.17,90.88 LCD1.1 ; v1(2.41,69.77) v1(10.54,69.77) 10.41,69.65 10.41,67.11 8.95,65.64 8.95,44.58 5.84,41.48 5.84,33.71 10.35,29.19 J3.5 ; v1(1.52,88.06) RP1.1 ; v1(89.28,18.47) v1(95.76,18.47)
V0: length 29
  Top Layer w0.4: RP1.2 9.78,86.66 11.05,85.39 27.81,85.39 32.13,89.71 32.13,92.51 LCD1.3
VCC: length 483.3
  Top Layer w0.6: 99.69,24.23 99.69,23.76 99.61,23.67 ; 99.69,24.23 99.69,27.1 100.6,28.01 ; 99.69,24.23 99.14,23.67 ; 99.69,24.23 100.22,23.71 100.22,23.67 ; R26.1 86.84,46.36 81.79,46.36 ; U1.40 40.39,43.99 41.27,44.88 62.23,44.88 63.12,45.77 RN1.1 64.01,46.91 64.64,46.28 64.64,45.26 65.41,44.5 75.82,44.5 ; U1.40 40.39,32.18 39.62,31.42 34.16,31.42 ; U1.40 40.13,42.6 34.04,42.6 31.83,44.8 C1.2 32.01,48.11 32.01,55.93 ; 92.61,44.5 93.08,44.5 ; 92.61,44.5 92.73,44.62 92.73,44.86 ; 92.61,44.5 92.3,44.5 ; 93.08,44.5 92.73,44.86 ; 93.08,44.5 v1(97.92,44.5) ; v1(44.2,16.43) 44.2,19.23 43.89,19.53 R10.1 42.93,17.79 ; 99.61,23.67 100.22,23.67 ; 99.61,23.67 99.14,23.67 ; 100.22,23.67 101.68,23.67 VT1.2 108.26,23.99 109.85,22.4 113.41,22.4 113.92,22.92 R3.2 116.87,24.18 116.89,24.2 116.95,24.2 117.09,24.05 125.86,24.05 127.25,22.66 130.43,22.66 130.68,22.91 R4.2 131.75,24.11 132.15,24.5 VT3.2 133.37,23.28 134.11,22.53 143.89,22.53 144.27,22.91 144.27,24.04 R5.2 146.89,24.18 147.08,23.99 184.72,23.99 186.82,26.09 186.82,60.76 184.9,62.68 R51.1 ; 5.46,80.57 5.59,80.44 ; U4.16 21.72,18.51 21.72,17.83 21.26,17.37 C11.2 18.67,16.31 20.4,14.58 C12.1 C10.2 24,13.18 24,11.73 24.89,10.85 26.67,10.85 27.56,11.73 27.56,13.64 28.7,14.78 42.04,14.78 42.93,15.67 42.93,16.58 ; 81.79,45.39 82.63,44.55 82.63,44.5 ; 81.79,45.39 81.59,45.19 ; 81.79,45.39 81.79,46.36 ; 75.82,44.5 76.58,44.5 ; 75.82,44.5 76.2,44.88 ; 76.58,44.5 76.2,44.88 ; 76.58,44.5 80.9,44.5 ; 99.14,23.67 R2.2 ; 81.59,45.19 82.28,44.5 ; 81.59,45.19 80.9,44.5 ; 82.28,44.5 82.63,44.5 ; 82.28,44.5 80.9,44.5 ; 100.6,28.01 100.6,27.97 ; 100.6,28.01 R23.1 99.06,35.23 97.92,36.37 v1(97.92,37.52) ; 42.93,16.58 42.32,17.19 ; 42.93,16.58 42.93,17.19 ; 92.73,44.93 92.73,44.86 ; 92.73,44.93 VT5.2 ; 92.73,44.93 92.3,44.5 ; 76.2,44.88 76.2,46.39 R27.1 ; 32.01,55.93 28.1,59.83 6.51,59.83 5.21,61.14 5.21,72.27 C33.1 5.21,72.36 U9.2 5.21,79.68 ; 32.01,55.93 32.26,55.68 ; C2.1 62.87,17.2 v1(61.47,15.8) ; 82.63,44.5 92.3,44.5 ; 34.04,31.42 34.16,31.42 ; 34.04,31.42 34.1,31.48 34.16,31.42 ; 34.04,31.42 33.15,30.53 33.15,17.45 33.41,17.19 42.32,17.19 ; 42.32,17.19 42.93,17.19 ; 42.32,17.19 42.93,17.79 ; 42.93,17.19 42.93,17.79 ; 5.21,81.21 U9.4 4.45,83.43 4.19,83.68 4.19,94.54 5.29,95.63 C4.1 10.03,95.63 C3.2 11.68,95.25 12.28,94.65 RP1.3 23.62,88.06 24.89,89.33 24.89,93.52 26.04,94.67 28.96,94.67 29.46,94.16 LCD1.2 ; 5.21,81.21 5.21,79.68 ; 5.21,81.21 5.94,80.47 5.94,80.42 ; 5.21,79.68 5.94,80.42 ; 81.79,46.36 VT6.2 ; T1.1 6.1,80.57 5.94,80.42
  Bottom Layer w0.6: v1(44.2,16.43) 44.83,15.8 v1(61.47,15.8) ; v1(97.92,37.52) v1(97.92,44.5)
VIN: length 256.1
  Top Layer w0.6: R16.1 68.91,46.02 66.17,46.02 65.53,46.66 65.53,58.09 ; 65.53,58.72 64.9,58.72 ; 65.53,58.72 65.53,58.09 ; 65.53,58.72 66.17,58.72 ; 64.9,58.72 65.53,58.09 ; 64.9,58.72 v1(32.77,58.72) ; R58.1 2.28,58.1 3.05,57.33 F1.2 7.49,58.72 v1(21.84,58.72) ; 66.17,58.72 102.49,58.72 110.49,66.73 C25.1 110.62,70.28 113.79,70.28 115.57,72.06 115.57,77.65 114.81,78.41 U6.6 112.65,78.41 111.89,79.17 111.89,81.46 112.65,82.22 113.54,82.22 114.17,82.85 114.17,89.2 R45.1 113.92,89.72 113.92,92.38 119.38,97.84 181.23,97.84 182.89,96.18 R52.1 183.77,94.41 184.4,93.78 184.4,90.09 C27.1 182.88,89.97 180.59,87.68 178.79,87.68 ; 66.17,58.72 65.53,58.09
  Bottom Layer w0.6: v1(21.84,58.72) v1(32.77,58.72)
DY: length 107
  Top Layer w0.254: R33.1 R21.1 178.2,28.77 177.55,28.12 173.74,28.12
  Bottom Layer w0.254: 140.3,3.32 140.17,3.45 K3.5 K3.5 K2.5 K2.5 111.26,3.53 K1.5 K1.5 ; 140.3,3.32 147.79,3.32 ; 140.3,3.32 140.17,3.32 ; 147.92,3.32 147.95,3.35 163.58,3.35 174.12,13.89 174.12,28.63
HS: length 143.8
  Top Layer w0.254: P1.3 178.69,6.44 J2.1 182.75,11.23 185.04,13.51 VD11.2 184.78,16.03 182.39,16.03 181.48,16.94 181.48,19.86 180.78,20.57 VD10.1 179.07,21.64 v1(178.18,22.53) ; 123.81,11.99 124.6,11.99 ; 123.81,11.99 124.21,12.38 ; 123.81,11.99 109.73,11.99 108.97,12.75 108.97,16.56 108.47,17.05 R12.1 ; 124.6,11.99 137.71,11.99 ; 124.6,11.99 124.21,12.38 ; 137.71,11.99 138.05,12.33 ; 137.71,11.99 138.14,11.99 ; 138.05,12.33 138.39,11.99 ; 138.05,12.33 138.05,12.08 138.14,11.99 ; 138.05,12.33 138.05,16.56 137.81,16.8 R14.1 ; v1(176.91,26.85) 178.07,26.85 R22.2 178.2,25.34 v1(178.18,25.32) ; 124.21,12.38 124.21,16.56 123.82,16.94 122.57,16.94 R13.1 ; 124.21,12.38 124.21,11.99 ; 138.39,11.99 152.27,11.99 153.16,12.88 153.16,15.93 152.53,16.56 151.4,16.56 R15.1 151.38,17.58 152.15,18.34 v1(153.67,18.34) ; 138.39,11.99 138.14,11.99
  Bottom Layer w0.254: v1(176.91,26.85) 176.91,29.9 176.02,30.78 U3.9 171.58,30.78 171.07,30.28 171.07,20.5 168.91,18.34 v1(153.67,18.34) ; v1(178.18,25.32) v1(178.18,22.53)
LEDA: length 59.3
  Top Layer w0.254: v1(77.98,51.87) R57.1
  Bottom Layer w0.254: v1(77.98,51.87) 63.75,51.87 62.48,53.14 LCD1.15
P0.0: length 50
  Bottom Layer w0.254: LCD1.7 42.8,92 42.8,42.85
P0.1: length 50
  Bottom Layer w0.254: LCD1.8 45.34,92 45.34,42.85
P0.2: length 50
  Bottom Layer w0.254: LCD1.9 47.24,50.85 47.88,50.22 47.88,42.85
P0.3: length 50
  Bottom Layer w0.254: 50.42,42.85 50.42,50.34 49.78,50.98 LCD1.10
P0.4: length 50
  Bottom Layer w0.254: LCD1.11 52.32,51.36 52.96,50.72 52.96,42.85
P0.5: length 50
  Bottom Layer w0.254: 55.5,42.85 55.5,50.47 54.86,51.1 LCD1.12
P0.6: length 50.3
  Bottom Layer w0.254: LCD1.13 57.4,51.36 58.29,50.47 58.29,47.29 58.04,47.04 58.04,42.85
P0.7: length 50
  Bottom Layer w0.254: LCD1.14 59.94,51.3 60.58,50.67 60.58,42.85
P1.0: length 128.2
  Top Layer w0.254: 140.92,41.2 142.37,41.2 143.24,42.07 R46.1 143.31,44.44 R42.2 ; VS1.1 142.54,36.88 140.95,38.47 140.95,40.46
  Bottom Layer w0.254: VS1.1 143.92,34.75 140.97,31.8 C17.2 134.19,30.65 41.39,30.65 40.13,29.39 40.13,27.86 U1.1 T7.1
P1.1: length 16.3
  Top Layer w0.254: 36.7,20.5 36.7,21.64 36.96,21.89 38.89,21.89 ; 39.24,21.54 39.24,21.85 39.2,21.89 ; 39.24,21.54 38.89,21.89 ; 39.24,21.54 39.6,21.89 ; 39.24,21.54 U2.3 ; 42.8,27.61 42.93,27.48 R10.2 42.56,21.89 39.6,21.89 ; 38.89,21.89 39.2,21.89 ; 39.6,21.89 39.2,21.89
P1.2: length 22.3
  Top Layer w0.254: S1.2 38.3,12.95 39.37,14.02 44.2,14.02 45.47,15.29 45.47,27.48 45.34,27.61
P1.3: length 16.7
  Top Layer w0.254: S2.2 48.59,26.9 47.88,27.61
P1.4: length 22.4
  Top Layer w0.254: 50.42,27.61 50.42,14.28 51.69,13 57.02,13 57.73,12.29 S3.2
P1.5: length 29.4
  Top Layer w0.254: 52.96,27.61 52.96,23.16 53.21,22.91 64.39,22.91 68.2,19.1 68.2,11.37 S4.2
P1.6: length 35.3
  Top Layer w0.254: 55.5,27.61 55.5,23.93 56.01,23.42 64.77,23.42 68.81,19.38 68.81,14.04 70.1,12.75 77.6,12.75 77.98,12.37 77.98,11.24 S5.2
P1.7: length 30.9
  Top Layer w0.254: R18.1 71.72,48.2 R16.2 v1(67.05,48.2) ; v1(63.25,44.39) 63.25,42.98 63.12,42.85 63.12,30.4 61.85,29.13 58.67,29.13 58.04,28.5 58.04,27.61
  Bottom Layer w0.254: v1(67.05,48.2) v1(63.25,44.39)
P2.3: length 17
  Top Layer w0.254: v1(90.8,46.41) R26.2 R29.2
  Bottom Layer w0.254: 80.9,42.85 80.9,43.74 81.28,44.12 90.42,44.12 90.8,44.5 v1(90.8,46.41)
P2.4: length 8
  Top Layer w0.254: v1(79.82,46.53) 78.34,46.53 R27.2 R30.2
  Bottom Layer w0.254: 78.36,42.85 79.82,44.31 v1(79.82,46.53)
P2.5: length 93.9
  Top Layer w0.254: v1(70.87,39.42) 75.06,39.42 75.95,40.31 75.95,42.72 75.82,42.85
  Bottom Layer w0.254: LCD1.6 37.08,90.09 37.08,43.23 40.89,39.42 v1(70.87,39.42)
P2.6: length 93.8
  Bottom Layer w0.254: LCD1.5 35.69,91.24 35.69,42.21 40.01,37.9 70.61,37.9 73.28,40.56 73.28,42.85
P2.7: length 92.7
  Top Layer w0.254: 70.74,42.85 70.74,41.2 66.67,37.13 v1(66.67,37.01)
  Bottom Layer w0.254: LCD1.4 34.54,41.45 38.99,37.01 v1(66.67,37.01)
P3.0: length 44.8
  Top Layer w0.254: U4.12 22.99,23.8 24.51,25.32 v1(25.27,25.32) ; v1(63.25,25.32) 63.25,27.48 63.12,27.61
  Bottom Layer w0.254: 25.15,25.32 v1(25.27,25.32) v1(63.25,25.32)
P3.1: length 46.2
  Top Layer w0.254: U4.11 23.37,25.07 24.38,26.09 v1(25.27,26.09)
  Bottom Layer w0.254: 65.66,27.61 65.91,27.36 65.91,26.47 65.53,26.09 v1(25.27,26.09)
P3.2: length 150.5
  Top Layer w0.254: v1(132.84,68.12) v1(144.53,68.12) ; 180.97,64.3 180.57,64.7 U8.4 ; v1(69.98,31.55) 69.09,31.55 68.2,30.66 68.2,27.73 U1.12
  Bottom Layer w0.254: v1(132.84,68.12) 114.3,68.12 108.58,62.41 108.58,33.83 106.3,31.55 v1(69.98,31.55) ; U8.4 176.78,66.09 174.75,68.12 v1(144.53,68.12)
P3.3: length 32.3
  Top Layer w0.254: 70.74,27.61 70.74,14.53 71.63,13.64 86.61,13.64 87.76,12.5 87.76,11.24 S6.2
P3.4: length 74.9
  Top Layer w0.254: v1(142.11,27.74) 142.11,26.23 R9.1 R5.1
  Bottom Layer w0.254: 73.28,27.61 75.96,30.29 140.19,30.29 142.11,28.37 v1(142.11,27.74)
P3.5: length 58.4
  Top Layer w0.254: v1(128.65,27.86) 128.65,26.48 R8.1 128.68,26.46 R4.1
  Bottom Layer w0.254: U1.15 78.23,29.9 126.87,29.9 128.65,28.12 v1(128.65,27.86)
P3.6: length 39.1
  Top Layer w0.254: R3.1 111.89,24.21 R7.1 112.14,26.51 v1(112.14,27.86)
  Bottom Layer w0.254: v1(112.14,27.86) 112.14,28.5 111.38,29.26 80.14,29.26 U1.16
P3.7: length 17.3
  Top Layer w0.254: v1(92.71,25.96) 95.18,25.96 R6.1 95.27,25.98 R2.1
  Bottom Layer w0.254: v1(92.71,25.96) 82.68,25.96 U1.17
RST: length 19.3
  Top Layer w0.254: R11.2 57.01,20.89 57.15,20.75 ; 62.77,21.31 C2.2 ; 62.77,21.31 62.77,21.99 62.48,22.28 v1(60.45,22.28) ; 62.77,21.31 D5.1 ; 60.58,27.61 60.45,27.48 v1(60.45,24.31)
  Bottom Layer w0.254: v1(60.45,22.28) v1(60.45,24.31)
$1N2346: length 18.6
  Bottom Layer w0.254: 93.47,34.16 83.69,34.16 83.44,34.41 83.44,42.85
$1N3452: length 5.4
  Top Layer w0.254: U6.8 118.63,80.95 R41.1
$1N4778: length 17.4
  Top Layer w0.254: L1.2 106.81,88.57 107.84,87.53 U6.1 107.97,80.82 109.73,80.82 110.36,81.46 110.36,83.47 110.77,83.87 112.86,83.87
$1N4799: length 8.2
  Top Layer w0.254: U6.3 106.55,78.41 105.66,79.3 105.66,81.2 104.69,82.18 C26.2
$1N5364: length 9
  Top Layer w0.254: C29.2 167.26,86.41 168.53,87.68 U7.3
$1N6563: length 15.4
  Top Layer w0.254: R52.2 171.7,94.41 173.1,93.01 173.1,90.33 ; 173.1,90.33 173.21,90.22 178.54,90.22 178.54,88.95 ; 173.1,90.33 173,90.22
$1N6721: length 16.8
  Top Layer w0.254: 179.05,76.15 179.2,76 179.2,75.93 ; 179.05,76.15 U7.5 ; 179.05,76.15 178.9,76 ; 179.2,75.93 R55.1 ; 179.2,75.93 181.24,75.93 R56.1
$1N6933: length 27
  Top Layer w0.254: VD16.1 170.39,88.27 170.69,88.57 v1(170.69,89.08) 173.38,89.08 U7.2
  Bottom Layer w0.254: v1(170.69,89.08) 168.78,89.08 167,90.86 155.6,90.86 L3.1
$1N7062: length 40.6
  Top Layer w0.254: L4.1 162.11,77.07 162.82,77.78 162.82,78.79 ; VD16.2 162.32,84.2 C29.1 162.26,81.76 162.81,81.2 C30.2 166.75,78.79 169.62,75.93 R55.2 173.41,86.32 U7.4
$1N8472: length 10
  Top Layer w0.254: U4.6 27.38,24.94 28.57,24.94 28.96,25.32 28.96,29.9 27.94,30.91 C16.2
$1N8708: length 7.9
  Top Layer w0.254: R30.1 76.22,49.22 76.83,49.83 81.15,49.83 81.93,49.06 81.93,48.24
$1N8711: length 4.6
  Top Layer w0.254: 83.93,47.29 83.8,47.42 R57.2
$1N8878: length 8.4
  Top Layer w0.254: R29.1 86.88,49.22 87.76,50.09 92.2,50.09 92.71,49.58 92.71,48.39 VT5.1
$1N8964: length 11.2
  Top Layer w0.254: VT5.3 94.73,50.45 96,51.73 LS1.1
$1N10683: length 14.9
  Top Layer w0.254: R20.2 160.13,39.65 RP2.3 163.58,40.44 164.21,41.07 166.12,41.07 U3.2
  Bottom Layer w0.254: RP2.2 RP2.3
$1N10733: length 39.2
  Top Layer w0.254: VD7.2 163.38,60.21 163.09,59.92 ; R17.1 164.21,59.87 164.47,59.61 164.47,52.33 VD6.1 165.35,52.12 166.12,52.88 166.12,53.64 165.61,54.15 v1(165.1,54.15)
  Bottom Layer w0.254: v1(165.1,54.15) 156.84,54.15 154.34,51.65 RP2.1
$1N10963: length 34.9
  Top Layer w0.254: v1(151.38,54.03) 151.38,54.53 152.96,56.11 C7.1 ; v1(151.51,35.61) 151.51,34.09 152.65,32.94 R25.2
  Bottom Layer w0.254: v1(151.51,35.61) 151.38,35.74 v1(151.38,54.03)
$1N11118: length 17.5
  Top Layer w0.254: C8.2 160.11,30.17 160.08,30.2 ; R28.2 160.08,30.2 ; 160.08,30.2 R25.1 160.3,32.69 161.8,32.69 163.19,34.09 163.19,37.39 164.08,38.28 166.12,38.28 U3.3
$1N11381: length 45.7
  Top Layer w0.254: v1(163.83,19.74) 163.83,17.96 162.81,16.94 RP3.3 RP3.2 ; R24.1 v1(165.23,49.33)
  Bottom Layer w0.254: v1(163.83,19.74) 163.83,30.02 164.59,30.78 U3.6 166.37,30.91 167.89,30.91 168.53,31.55 168.53,48.18 167.39,49.33 v1(165.23,49.33)
$1N11443: length 6.8
  Top Layer w0.254: R19.2 156,10.31 RP3.1
$1N11625: length 32.4
  Top Layer w0.254: v1(159,49.33) R24.2 161.09,51.89 VD6.2 162.31,52.12 163.08,52.9 C7.2 163.01,56.18 161.54,56.18 161.18,56.55 R17.2 161.05,59.74 160.4,59.74 159.98,60.16 VD7.1 ; T4.1 163.07,43.48 U3.1
  Bottom Layer w0.254: T4.1 161.54,44.75 159.64,44.75 159,45.39 v1(159,49.33)
$1N12335: length 3.4
  Top Layer w0.254: R21.2 R22.1
$1N12640: length 17.7
  Top Layer w0.254: C15.1 C14.1 181.48,43.1 180.32,41.94 R37.1 181.23,39.67 181.74,39.17 181.74,33.96 181.34,33.56 R33.2
$1N12663: length 15.3
  Top Layer w0.254: 173.61,40.82 173.61,41.33 174.24,41.96 175.89,41.96 177.03,43.1 C14.2 178.21,43.1 179.7,43.1 180.16,43.56 R35.1
$1N15631: length 13.6
  Top Layer w0.254: U5.3 123.82,51.87 123.82,48.82 123.32,48.31 118.62,48.31 118.25,48.68 118.25,49.71
$1N15730: length 19.8
  Top Layer w0.254: 117.49,59.84 116.69,59.84 115.95,59.11 115.95,56.18 116.59,55.55 118.25,55.55 R34.2 ; R34.2 118.38,53.01 118.13,52.76 ; R34.2 118.24,55.82 118.24,56.57 118.62,56.95 U5.2
$1N15734: length 12.3
  Top Layer w0.254: VD13.1 117.43,62.46 118.36,61.52 120.52,61.52 120.9,61.14 120.9,59.85 VD12.2 126.01,59.84 U5.1
$1N15742: length 32.4
  Top Layer w0.254: v1(122.43,53.39) 121.79,52.76 R31.1 ; VD13.2 122.17,63.8 v1(122.55,63.42) ; 119.13,40.44 117.22,40.44 115.2,42.46 115.2,49.15 117.28,51.23 118.6,51.23 120.13,52.76
  Bottom Layer w0.254: v1(122.55,63.42) 122.81,63.17 122.81,53.77 v1(122.43,53.39)
$1N15748: length 13
  Top Layer w0.254: R32.1 R36.2 120.63,40.69 122.94,40.69 123.06,40.82 v1(123.06,43.36)
  Bottom Layer w0.254: U5.6 126.36,46.66 v1(123.06,43.36)
$1N15796: length 11.6
  Top Layer w0.254: v1(124.46,48.56) 125.22,49.33 U5.5 ; v1(123.19,45.14) 119.52,45.14 118.25,43.87
  Bottom Layer w0.254: v1(124.46,48.56) 124.46,46.41 v1(123.19,45.14)
$1N16442: length 7.3
  Top Layer w0.254: U5.8 141.11,44.25 R46.2
$1N16458: length 9.9
  Top Layer w0.254: R47.2 R42.1 141.27,46.79 U5.9
$1N16661: length 6.5
  Top Layer w0.254: U8.1 168.14,65.71 R50.2
$1N16668: length 37.2
  Bottom Layer w0.254: U5.14 134.24,59.74 168.27,59.74 169.16,60.63 U8.2
$1N16931: length 93.7
  Top Layer w0.254: v1(122.43,49.71) 120.25,49.71 ; v1(140.33,54.91) 139.7,54.91 137.67,56.95 v1(135.89,56.95) ; v1(122.43,44.25) 121.79,43.61 120.51,43.61 120.25,43.87 ; 173.61,43.74 v1(173.61,45.26) 174.93,46.58 C15.2 178.16,46.63 R35.2 178.27,50.95 T6.1 ; 173.61,43.74 173.61,43.36 ; 173.61,43.74 U3.14
  Bottom Layer w0.254: v1(140.33,54.91) 172.34,54.91 173.61,53.64 v1(173.61,45.26) ; v1(135.89,56.95) U5.13 132.59,56.95 131.83,56.18 131.83,51.61 131.05,50.84 123.05,50.84 122.43,50.22 v1(122.43,49.71) v1(122.43,44.25)
$1N17348: length 7.3
  Top Layer w0.254: v1(100.71,26.09) 101.8,26.09 VT1.1 ; R6.2 97.27,26.05 v1(98.59,26.05)
  Bottom Layer w0.254: v1(100.71,26.09) 98.63,26.09 98.55,26.01 100.78,26.01 100.89,25.89
$1N17399: length 3.8
  Top Layer w0.254: 103.81,16 104.9,14.91 106.92,14.91 R12.2
$1N17441: length 30.9
  Top Layer w0.254: v1(103.5,21.51) 103.5,20.5 103.12,20.12 99.15,20.12 99.15,21.17 98.42,21.89 92.71,21.89 92.07,21.26 92.07,15.6 93.94,13.73 95.85,13.73 K1.4 ; VT1.3 v1(105.41,24.94)
  Bottom Layer w0.254: v1(105.41,24.94) 105.41,22.06 104.87,21.51 v1(103.5,21.51)
$1N18975: length 3.1
  Top Layer w0.254: VT2.1 116.72,26.26 R7.2
$1N18989: length 4.1
  Top Layer w0.254: R13.2 120.08,14.93 K2.1
$1N19002: length 25.7
  Top Layer w0.254: K2.4 109.85,15.1 109.85,21.01 110.36,21.51 115.57,21.51 116.25,20.83 VD2.1 118.87,19.99 v1(120.4,21.51) ; VT2.3 v1(120.4,25.15)
  Bottom Layer w0.254: v1(120.4,25.15) v1(120.4,21.51)
$1N19254: length 2.8
  Top Layer w0.254: 133.37,26.27 133.17,26.47 R8.2
$1N19268: length 3.9
  Top Layer w0.254: R14.2 134.81,14.8 K3.1
$1N19281: length 29
  Top Layer w0.254: v1(137.16,25.32) 135.49,25.32 VT3.3 ; K3.4 125.86,13.51 124.97,13.51 124.59,13.89 124.59,20.37 125.98,21.77 129.92,21.77 130.64,21.04 VD3.1 134.11,19.99 v1(134.12,20)
  Bottom Layer w0.254: v1(134.12,20) 135.9,20 137.16,21.26 v1(137.16,25.32)
$1N19533: length 3
  Top Layer w0.254: R9.2 146.89,26.21 VT4.1
$1N19547: length 4
  Top Layer w0.254: R15.2 149.29,14.54 147.92,15.92
$1N19560: length 28.4
  Top Layer w0.254: v1(151.13,25.07) 149.21,25.07 149.08,24.94 ; v1(151.06,20.17) 151.01,20.12 VD4.1 145.38,20.79 144.53,21.64 140.21,21.64 138.68,20.12 138.68,14.97 K4.4
  Bottom Layer w0.254: v1(151.13,25.07) 151.13,22.28 151.06,22.21 v1(151.06,20.17)
$1N23681: length 40.8
  Top Layer w0.254: v1(119.38,82.73) 120.14,82.73 120.76,82.11 R41.2 ; v1(114.94,79.68) U6.7
  Bottom Layer w0.254: R45.2 119.76,89.59 119.38,89.2 119.38,87.21 ; 119.38,86.33 119.38,86.07 ; 119.38,86.33 119.04,86.66 ; 119.38,86.33 119.38,86.66 ; 119.38,86.07 119.35,86.07 118.75,86.66 ; 119.38,86.07 v1(119.38,82.73) 116.08,82.73 115.06,81.71 115.06,79.81 v1(114.94,79.68) ; 119.38,86.95 119.28,86.85 118.94,86.85 ; 119.38,86.95 119.38,86.66 ; 119.38,86.95 119.38,87.21 ; 119.38,86.66 119.38,86.66 119.04,86.66 ; 119.38,87.21 119.29,87.21 118.94,86.85 ; 119.04,86.66 118.75,86.66 ; L1.1 109.94,87.21 110.49,86.66 118.75,86.66 ; 118.94,86.85 118.75,86.66
$1N61076: length 52.2
  Top Layer w0.254: R19.1 158.1,6.94 T5.1 158.33,6.4 P1.1 174.37,7.12 J1.1 174.5,11.35 176.15,11.35 176.53,11.73 176.53,15.42 175.66,16.29 VD9.2 172.49,16.29 172.08,16.69 172.08,19.35 170.75,20.69 VD8.1 169.22,20.62 v1(166.24,20.62)
  Bottom Layer w0.254: v1(166.24,20.62) U3.7
$1N110268: length 3.2
  Top Layer w0.254: C13.1 30.15,22.53 U4.4
$1N110273: length 3.3
  Top Layer w0.254: U4.5 28.57,23.8 29.08,24.31 30.3,24.31 30.35,24.26
$1N110278: length 3.2
  Top Layer w0.254: C9.1 30.18,18.72 U4.1
$1N110283: length 3.5
  Top Layer w0.254: U4.3 28.32,21.26 29.13,20.45 C9.2
$1N110292: length 7.9
  Top Layer w0.254: U4.2 26.26,19.99 25.91,19.64 25.91,13.34 25.98,13.26
$1N110341: length 11.6
  Top Layer w0.254: 85.98,27.61 86.26,27.33 Y1.1 86.26,19.89 85.22,18.85 85.22,16.61 C6.2
$1N110354: length 13
  Top Layer w0.254: 83.44,27.61 83.44,22.53 82.42,21.51 81.51,21.51 Y1.2 80.06,20.32 C5.2
$1N135967: length 21.8
  Top Layer w0.254: U5.10 136.27,49.33 139.87,52.93 C23.1 ; v1(132.21,39.29) 132.21,37.2 132.16,37.16
  Bottom Layer w0.254: U5.10 132.21,47.55 v1(132.21,39.29)
$1N136047: length 10.3
  Top Layer w0.254: C17.1 130.19,31.95 R44.2 R40.1
$1N136085: length 16.5
  Top Layer w0.254: C28.2 141.44,64.53 R54.1 141.44,59.13 R53.2 140.35,59 v1(140.08,58.72)
  Bottom Layer w0.254: U5.12 138.56,54.41 139.7,55.55 139.7,58.34 v1(140.08,58.72)
$1N136120: length 29.7
  Top Layer w0.254: R40.2 123.97,36.13 123.57,35.74 119.13,35.74 118.51,36.36 R32.2 114.87,37.83 112.2,35.16 T9.1 ; v1(123.82,42.47) 123.82,37.9
  Bottom Layer w0.254: v1(123.82,42.47) 125.6,44.25 U5.7
$1N153519: length 11.8
  Top Layer w0.254: v1(113.92,75.49) 113.39,76.02 U6.5 ; v1(116.89,75.49) 117.22,75.82 117.22,78.41 117.73,78.92 R43.2 118.73,76.89 R48.2
  Bottom Layer w0.254: v1(113.92,75.49) v1(116.89,75.49)
$1N153534: length 28.3
  Top Layer w0.254: 122.43,79.55 122.43,82.73 121.28,83.87 116.25,83.87 ; 122.43,79.55 122.22,79.34 ; 122.43,79.55 122.64,79.34 ; 122.22,79.34 122.47,79.08 ; 122.22,79.34 122.64,79.34 ; 122.22,79.34 121.96,79.08 ; 122.47,79.08 121.96,79.08 ; 122.47,79.08 122.9,79.08 ; 122.93,79.05 123.06,78.92 ; 122.93,79.05 122.93,78.92 ; 122.93,79.05 122.9,79.08 ; 123.06,78.92 122.93,78.92 ; 123.06,78.92 130.68,78.92 130.94,78.66 ; 122.64,79.34 122.9,79.08 ; 121.96,79.08 121.79,78.92 ; 130.94,78.92 131.16,79.14 L2.1 ; 122.93,78.92 121.79,78.92 ; 121.79,78.92 121.12,78.92
$1N161943: length 9.7
  Top Layer w0.254: U4.14 12.31,21.26 J3.2
$1N161952: length 10
  Top Layer w0.254: J3.3 16.76,23.67 17.91,22.53 U4.13
$1N174845: length 21.6
  Top Layer w0.254: P2.2 15.75,47.17 17.65,49.07 17.65,54.03 16.89,54.79 S7.2
$1N174849: length 22.6
  Top Layer w0.254: R58.2 17.28,71.8 16.51,72.57 C32.1 13.08,72.65 13.08,76.89 12.26,77.71 U9.3
$1N174850: length 13.1
  Top Layer w0.254: F1.1 6.1,51.1 6.6,50.6 15.37,50.6 15.87,51.1 15.87,52.62 S7.1
$1N187286: length 9.3
  Top Layer w0.254: v1(101.73,32.56) 102.6,33.44 R23.2 ; 96.14,34.21 v1(97.79,32.56)
  Bottom Layer w0.254: v1(101.73,32.56) v1(97.79,32.56)

Small or netless copper shapes (teardrops, artwork), in the pictures only: 572 on Top Layer, 235 on Bottom Layer

## Text on the board
Top Silkscreen Layer: Cx | 背光/校准 | ↑ | ↓ | ← | → | OK | 数字电容表
